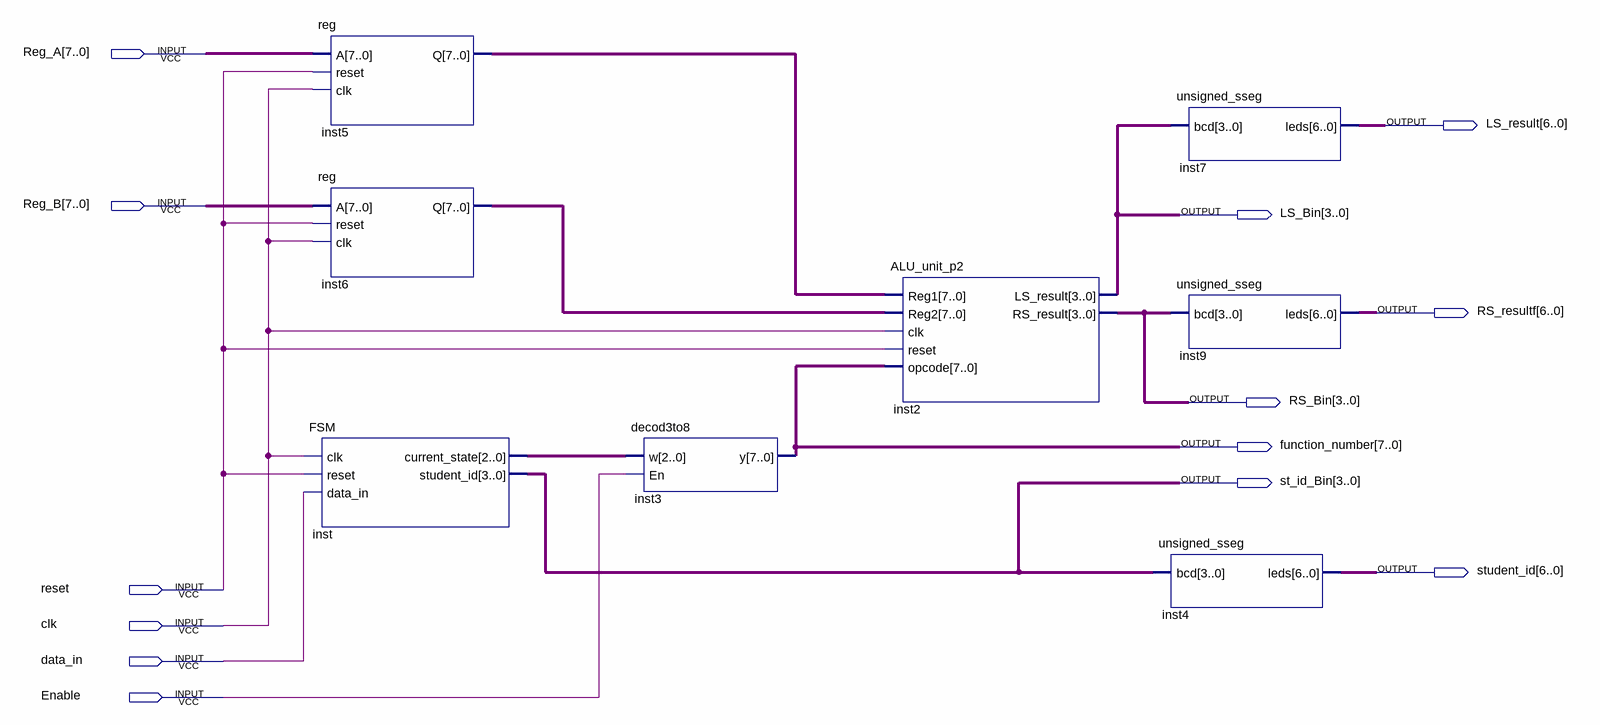
[diagram p0: schematic sheet]
// Quartus schematic Final_Desgin_p2.bdf as structural Verilog: 8 symbols, 13 pins
module Final_Desgin_p2 (
  input  [7:0] Reg_A,
  input  [7:0] Reg_B,
  input  reset,
  input  clk,
  input  data_in,
  input  Enable,
  output [6:0] LS_result,
  output [3:0] LS_Bin,
  output [6:0] RS_resultf,
  output [3:0] RS_Bin,
  output [7:0] function_number,
  output [3:0] st_id_Bin,
  output [6:0] student_id
);

  wire [2:0] inst_current_state;
  wire [7:0] inst5_q, inst6_q;

  \reg  inst5 (.A(Reg_A), .reset(reset), .clk(clk), .Q(inst5_q));
  \reg  inst6 (.A(Reg_B), .reset(reset), .clk(clk), .Q(inst6_q));
  FSM inst (.clk(clk), .reset(reset), .data_in(data_in), .current_state(inst_current_state), .student_id(st_id_Bin));
  decod3to8 inst3 (.w(inst_current_state), .En(Enable), .y(function_number));
  ALU_unit_p2 inst2 (
    .Reg1(inst5_q), .Reg2(inst6_q), .clk(clk), .reset(reset), .opcode(function_number), .LS_result(LS_Bin),
    .RS_result(RS_Bin));
  unsigned_sseg inst7 (.bcd(LS_Bin), .leds(LS_result));
  unsigned_sseg inst9 (.bcd(RS_Bin), .leds(RS_resultf));
  unsigned_sseg inst4 (.bcd(st_id_Bin), .leds(student_id));
endmodule
